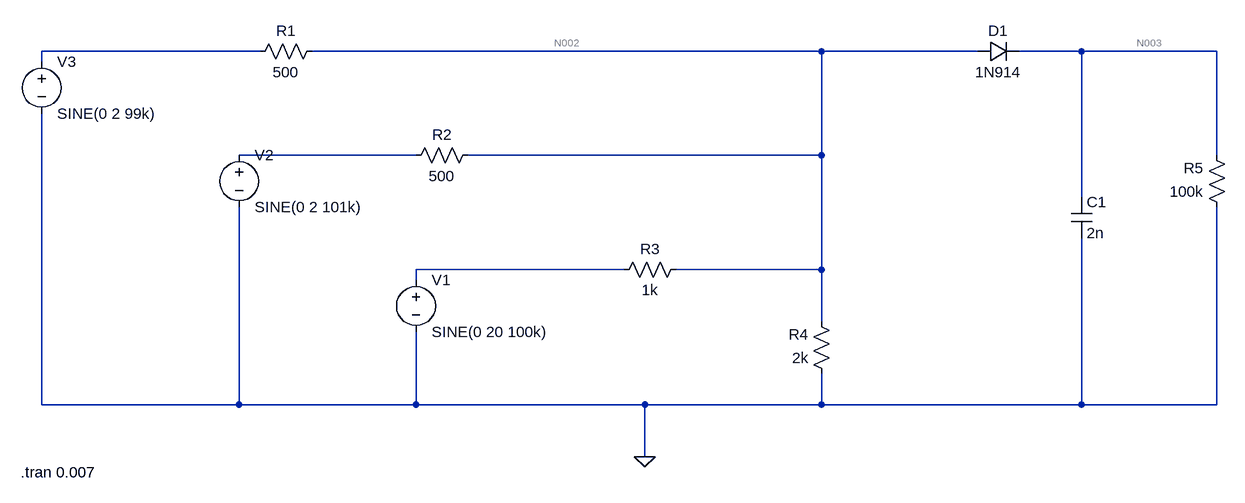
[diagram p0: schematic Envelope Detector.asc]
Envelope Detector.asc, the LTspice schematic file:
Version 4.1
SHEET 1 1492 680
WIRE 0 -176 -336 -176
WIRE 864 -176 80 -176
WIRE 1104 -176 864 -176
WIRE 1264 -176 1168 -176
WIRE 1472 -176 1264 -176
WIRE -336 -160 -336 -176
WIRE 240 -16 -32 -16
WIRE 864 -16 864 -176
WIRE 864 -16 320 -16
WIRE 1472 -16 1472 -176
WIRE 1264 48 1264 -176
WIRE 560 160 240 160
WIRE 864 160 864 -16
WIRE 864 160 640 160
WIRE 240 176 240 160
WIRE 864 240 864 160
WIRE -336 368 -336 -80
WIRE -32 368 -32 64
WIRE -32 368 -336 368
WIRE 240 368 240 256
WIRE 240 368 -32 368
WIRE 592 368 240 368
WIRE 864 368 864 320
WIRE 864 368 592 368
WIRE 1264 368 1264 112
WIRE 1264 368 864 368
WIRE 1472 368 1472 64
WIRE 1472 368 1264 368
WIRE 592 448 592 368
FLAG 592 448 0
SYMBOL voltage 240 160 R0
WINDOW 123 0 0 Left 0
WINDOW 39 0 0 Left 0
SYMATTR InstName V1
SYMATTR Value SINE(0 20 100k)
SYMBOL voltage -32 -32 R0
WINDOW 123 0 0 Left 0
WINDOW 39 0 0 Left 0
SYMATTR InstName V2
SYMATTR Value SINE(0 2 101k)
SYMBOL voltage -336 -176 R0
WINDOW 123 0 0 Left 0
WINDOW 39 0 0 Left 0
SYMATTR InstName V3
SYMATTR Value SINE(0 2 99k)
SYMBOL res 96 -192 R90
WINDOW 0 0 56 VBottom 2
WINDOW 3 32 56 VTop 2
SYMATTR InstName R1
SYMATTR Value 500
SYMBOL res 336 -32 R90
WINDOW 0 0 56 VBottom 2
WINDOW 3 32 56 VTop 2
SYMATTR InstName R2
SYMATTR Value 500
SYMBOL res 656 144 R90
WINDOW 0 0 56 VBottom 2
WINDOW 3 32 56 VTop 2
SYMATTR InstName R3
SYMATTR Value 1k
SYMBOL res 880 336 R180
WINDOW 0 36 76 Left 2
WINDOW 3 36 40 Left 2
SYMATTR InstName R4
SYMATTR Value 2k
SYMBOL res 1488 80 R180
WINDOW 0 36 76 Left 2
WINDOW 3 36 40 Left 2
SYMATTR InstName R5
SYMATTR Value 100k
SYMBOL diode 1104 -160 R270
WINDOW 0 32 32 VTop 2
WINDOW 3 0 32 VBottom 2
SYMATTR InstName D1
SYMATTR Value 1N914
SYMBOL cap 1248 48 R0
SYMATTR InstName C1
SYMATTR Value 2n
TEXT -368 472 Left 2 !.tran 0.007

The netlist it stands for:
* Envelope Detector.asc
V1 N005 0 SINE(0 20 100k)
V2 N004 0 SINE(0 2 101k)
V3 N001 0 SINE(0 2 99k)
R1 N002 N001 500
R2 N002 N004 500
R3 N002 N005 1k
R4 0 N002 2k
R5 0 N003 100k
D1 N002 N003 1N914
C1 N003 0 2n
.model D D
.lib standard.dio
.tran 0.007
.backanno
.end

* Results of the author's LTspice run, read from the files saved beside the schematic
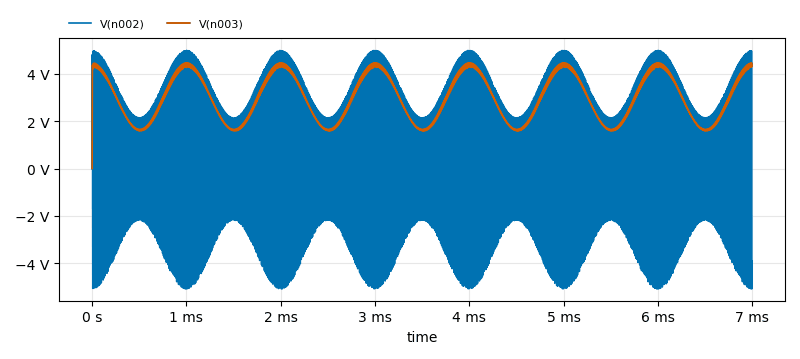
[diagram p1: Transient Analysis of Envelope Detector.asc, plotted from the saved traces]
* Transient Analysis, 1 run:
*   V(n002): min -5.087 V, max 4.999 V, average -2.212 mV, rms 2.684 V, last -1.647 mV
*   V(n003): min 0 V, max 4.472 V, average 2.994 V, rms 3.148 V, last 4.306 V